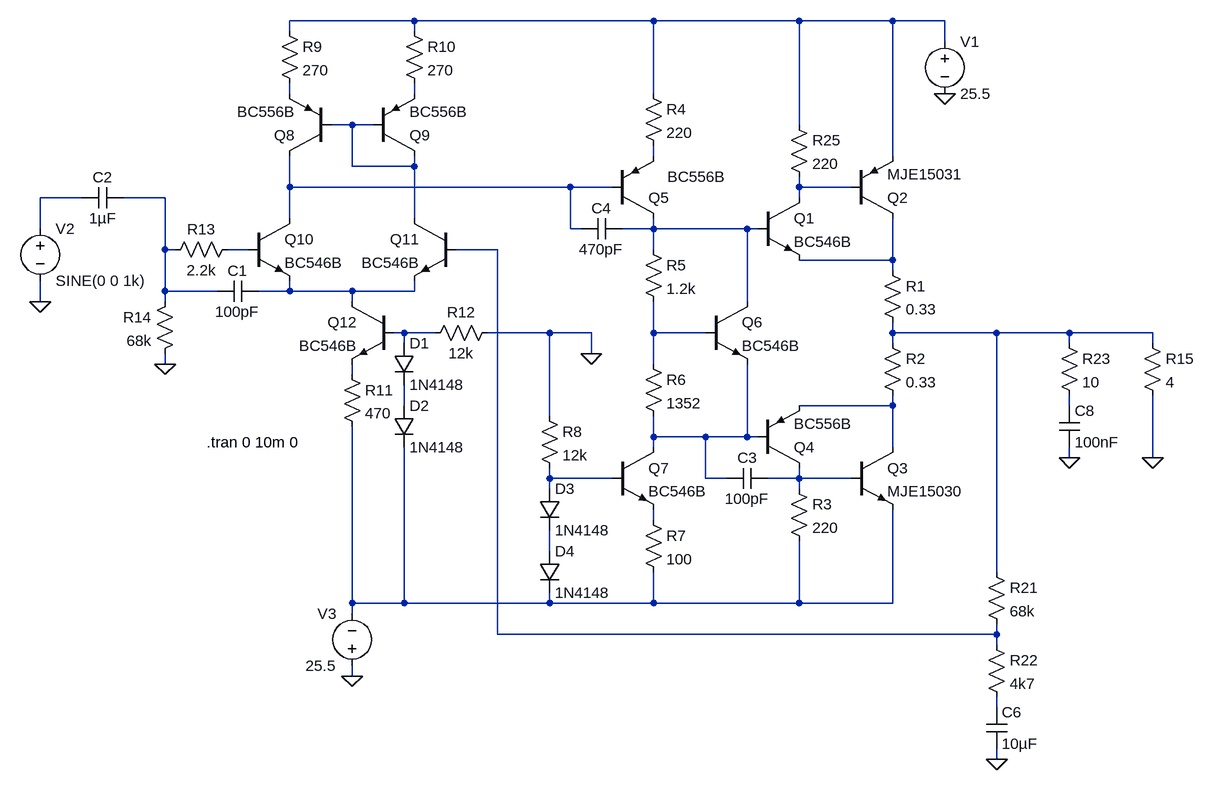
[diagram p0: schematic amp.asc]
amp.asc, the LTspice schematic file:
Version 4
SHEET 1 896 1012
WIRE -512 -144 -704 -144
WIRE -144 -144 -512 -144
WIRE 80 -144 -144 -144
WIRE 224 -144 80 -144
WIRE 304 -144 224 -144
WIRE -704 -128 -704 -144
WIRE -512 -128 -512 -144
WIRE 304 -112 304 -144
WIRE -704 -32 -704 -48
WIRE -512 -32 -512 -48
WIRE -144 -32 -144 -144
WIRE -608 16 -640 16
WIRE -576 16 -608 16
WIRE 80 16 80 -144
WIRE -144 64 -144 48
WIRE 224 64 224 -144
WIRE -608 80 -608 16
WIRE -512 80 -512 64
WIRE -512 80 -608 80
WIRE -704 112 -704 64
WIRE -272 112 -704 112
WIRE -208 112 -272 112
WIRE 80 112 80 96
WIRE 160 112 80 112
WIRE -1024 128 -1088 128
WIRE -896 128 -960 128
WIRE 80 128 80 112
WIRE -704 160 -704 112
WIRE -512 160 -512 80
WIRE -1088 176 -1088 128
WIRE -272 176 -272 112
WIRE -256 176 -272 176
WIRE -144 176 -144 160
WIRE -144 176 -192 176
WIRE 0 176 -144 176
WIRE 16 176 0 176
WIRE -896 208 -896 128
WIRE -880 208 -896 208
WIRE -768 208 -800 208
WIRE -384 208 -448 208
WIRE -144 208 -144 176
WIRE 224 224 224 160
WIRE 224 224 80 224
WIRE 224 240 224 224
WIRE -896 272 -896 208
WIRE -816 272 -896 272
WIRE -704 272 -704 256
WIRE -704 272 -752 272
WIRE -608 272 -704 272
WIRE -512 272 -512 256
WIRE -512 272 -608 272
WIRE -1088 288 -1088 256
WIRE -896 288 -896 272
WIRE -608 288 -608 272
WIRE 0 288 0 176
WIRE -528 336 -544 336
WIRE -480 336 -528 336
WIRE -304 336 -400 336
WIRE -240 336 -304 336
WIRE -144 336 -144 288
WIRE -64 336 -144 336
WIRE 224 336 224 320
WIRE 384 336 224 336
WIRE 496 336 384 336
WIRE 624 336 496 336
WIRE -528 352 -528 336
WIRE 224 352 224 336
WIRE 496 352 496 336
WIRE 624 352 624 336
WIRE -240 368 -240 336
WIRE -896 384 -896 368
WIRE -144 384 -144 336
WIRE -608 400 -608 384
WIRE -528 448 -528 416
WIRE 224 448 224 432
WIRE 224 448 80 448
WIRE 496 448 496 432
WIRE -304 464 -304 336
WIRE -144 496 -144 464
WIRE -64 496 -144 496
WIRE 0 496 0 384
WIRE 0 496 -64 496
WIRE 16 496 0 496
WIRE -144 512 -144 496
WIRE 224 512 224 448
WIRE 496 528 496 512
WIRE 624 528 624 432
WIRE -304 560 -304 544
WIRE -208 560 -304 560
WIRE -64 560 -64 496
WIRE -32 560 -64 560
WIRE 80 560 80 544
WIRE 80 560 32 560
WIRE 160 560 80 560
WIRE -304 576 -304 560
WIRE 80 576 80 560
WIRE -144 624 -144 608
WIRE -304 672 -304 640
WIRE 384 704 384 336
WIRE -608 752 -608 480
WIRE -528 752 -528 512
WIRE -528 752 -608 752
WIRE -304 752 -304 736
WIRE -304 752 -528 752
WIRE -144 752 -144 704
WIRE -144 752 -304 752
WIRE 80 752 80 656
WIRE 80 752 -144 752
WIRE 224 752 224 608
WIRE 224 752 80 752
WIRE -608 768 -608 752
WIRE -384 800 -384 208
WIRE 384 800 384 784
WIRE 384 800 -384 800
WIRE 384 816 384 800
WIRE -608 864 -608 848
WIRE 384 912 384 896
WIRE 384 992 384 976
FLAG -896 384 0
FLAG 304 -32 0
FLAG 384 992 0
FLAG 496 528 0
FLAG -608 864 0
FLAG -240 368 0
FLAG 624 528 0
FLAG -1088 288 0
SYMBOL npn 16 128 R0
SYMATTR InstName Q1
SYMATTR Value BC546B
SYMBOL pnp 160 160 M180
SYMATTR InstName Q2
SYMATTR Value MJE15031
SYMBOL res 64 0 R0
SYMATTR InstName R25
SYMATTR Value 220
SYMBOL res 208 224 R0
SYMATTR InstName R1
SYMATTR Value 0.33
SYMBOL res 208 336 R0
SYMATTR InstName R2
SYMATTR Value 0.33
SYMBOL npn 160 512 R0
SYMATTR InstName Q3
SYMATTR Value MJE15030
SYMBOL pnp 16 544 M180
SYMATTR InstName Q4
SYMATTR Value BC556B
SYMBOL res 64 560 R0
SYMATTR InstName R3
SYMATTR Value 220
SYMBOL pnp -208 160 M180
WINDOW 3 85 64 Left 2
SYMATTR Value BC556B
SYMATTR InstName Q5
SYMBOL res -160 -48 R0
SYMATTR InstName R4
SYMATTR Value 220
SYMBOL npn -64 288 R0
SYMATTR InstName Q6
SYMATTR Value BC546B
SYMBOL res -160 192 R0
SYMATTR InstName R5
SYMATTR Value 1.2k
SYMBOL res -160 368 R0
SYMATTR InstName R6
SYMATTR Value 1352
SYMBOL diode -544 352 R0
SYMATTR InstName D1
SYMATTR Value 1N4148
SYMBOL diode -544 448 R0
SYMATTR InstName D2
SYMATTR Value 1N4148
SYMBOL npn -208 512 R0
SYMATTR InstName Q7
SYMATTR Value BC546B
SYMBOL res -160 608 R0
SYMATTR InstName R7
SYMATTR Value 100
SYMBOL res -320 448 R0
SYMATTR InstName R8
SYMATTR Value 12k
SYMBOL pnp -640 64 R180
SYMATTR InstName Q8
SYMATTR Value BC556B
SYMBOL pnp -576 64 M180
SYMATTR InstName Q9
SYMATTR Value BC556B
SYMBOL npn -768 160 R0
SYMATTR InstName Q10
SYMATTR Value BC546B
SYMBOL npn -448 160 M0
SYMATTR InstName Q11
SYMATTR Value BC546B
SYMBOL res -720 -144 R0
SYMATTR InstName R9
SYMATTR Value 270
SYMBOL res -528 -144 R0
SYMATTR InstName R10
SYMATTR Value 270
SYMBOL npn -544 288 M0
SYMATTR InstName Q12
SYMATTR Value BC546B
SYMBOL res -624 384 R0
SYMATTR InstName R11
SYMATTR Value 470
SYMBOL res -384 320 R90
WINDOW 0 0 56 VBottom 2
WINDOW 3 32 56 VTop 2
SYMATTR InstName R12
SYMATTR Value 12k
SYMBOL diode -320 576 R0
SYMATTR InstName D3
SYMATTR Value 1N4148
SYMBOL diode -320 672 R0
SYMATTR InstName D4
SYMATTR Value 1N4148
SYMBOL cap -752 256 R90
WINDOW 0 0 32 VBottom 2
WINDOW 3 32 32 VTop 2
SYMATTR InstName C1
SYMATTR Value 100pF
SYMBOL res -784 192 R90
WINDOW 0 0 56 VBottom 2
WINDOW 3 32 56 VTop 2
SYMATTR InstName R13
SYMATTR Value 2.2k
SYMBOL res -880 272 M0
SYMATTR InstName R14
SYMATTR Value 68k
SYMBOL cap -960 112 R90
WINDOW 0 0 32 VBottom 2
WINDOW 3 32 32 VTop 2
SYMATTR InstName C2
SYMATTR Value 1µF
SYMBOL cap -192 160 R90
WINDOW 0 0 32 VBottom 2
WINDOW 3 32 32 VTop 2
SYMATTR InstName C4
SYMATTR Value 470pF
SYMBOL voltage 304 -128 R0
WINDOW 123 0 0 Left 2
WINDOW 39 0 0 Left 2
SYMATTR InstName V1
SYMATTR Value 25.5
SYMBOL res 368 688 R0
SYMATTR InstName R21
SYMATTR Value 68k
SYMBOL res 368 800 R0
SYMATTR InstName R22
SYMATTR Value 4k7
SYMBOL cap 368 912 R0
SYMATTR InstName C6
SYMATTR Value 10µF
SYMBOL res 480 336 R0
SYMATTR InstName R23
SYMATTR Value 10
SYMBOL cap 480 448 R0
SYMATTR InstName C8
SYMATTR Value 100nF
SYMBOL cap 32 544 R90
WINDOW 0 0 32 VBottom 2
WINDOW 3 32 32 VTop 2
SYMATTR InstName C3
SYMATTR Value 100pF
SYMBOL voltage -608 864 R180
WINDOW 0 24 96 Left 2
WINDOW 3 24 16 Left 2
WINDOW 123 0 0 Left 2
WINDOW 39 0 0 Left 2
SYMATTR InstName V3
SYMATTR Value 25.5
SYMBOL voltage -1088 160 R0
WINDOW 123 0 0 Left 2
WINDOW 39 0 0 Left 2
SYMATTR InstName V2
SYMATTR Value SINE(0 0 1k)
SYMBOL res 608 336 R0
SYMATTR InstName R15
SYMATTR Value 4
TEXT -832 504 Left 2 !.tran 0 10m 0

The netlist it stands for:
* amp.asc
Q1 N007 N010 N013 0 BC546B
Q2 N013 N007 N001 0 MJE15031
R25 N001 N007 220
R1 N013 N017 0.33
R2 N017 N020 0.33
Q3 N020 N024 N027 0 MJE15030
Q4 N024 N022 N020 0 BC556B
R3 N024 N027 220
Q5 N010 N006 N005 0 BC556B
R4 N001 N005 220
Q6 N010 N016 N022 0 BC546B
R5 N010 N016 1.2k
R6 N016 N022 1352
D1 N015 N019 1N4148
D2 N019 N027 1N4148
Q7 N022 N023 N025 0 BC546B
R7 N025 N027 100
R8 0 N023 12k
Q8 N006 N004 N002 0 BC556B
Q9 N004 N004 N003 0 BC556B
Q10 N006 N011 N014 0 BC546B
Q11 N004 N012 N014 0 BC546B
R9 N001 N002 270
R10 N001 N003 270
Q12 N014 N015 N018 0 BC546B
R11 N018 N027 470
R12 0 N015 12k
D3 N023 N026 1N4148
D4 N026 N027 1N4148
C1 N014 N009 100pF
R13 N011 N009 2.2k
R14 N009 0 68k
C2 N009 N008 1µF
C4 N010 N006 470pF
V1 N001 0 25.5
R21 N017 N012 68k
R22 N012 N028 4k7
C6 N028 0 10µF
R23 N017 N021 10
C8 N021 0 100nF
C3 N024 N022 100pF
V3 0 N027 25.5
V2 N008 0 SINE(0 0 1k)
R15 N017 0 4
.model D D
.lib standard.dio
.model NPN NPN
.model PNP PNP
.lib standard.bjt
.tran 0 10m 0
.backanno
.end